# Altium schematic sheet [03] - REVISION HISTORY.SchDoc: Revision History
size A3; SheetNumber: 3; SheetTotal: 5
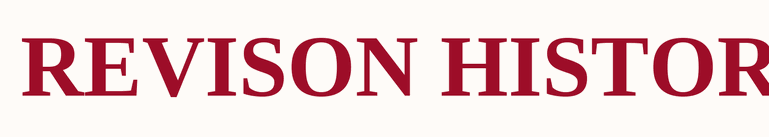
[diagram p0: [03] - REVISION HISTORY.SchDoc]

## Notes on the sheet
- REVISON HISTORY
- Title:
- Desc:
- Designed by:
- Checked by:
- Date:
- Document No:
- Revision:
- Size:
- A3
- Approved by:
- Sheet
- of